# EasyEDA Pro project ProProject_aDataFlow_v2_pub_2024-01-13.epro, board PCB_front_1
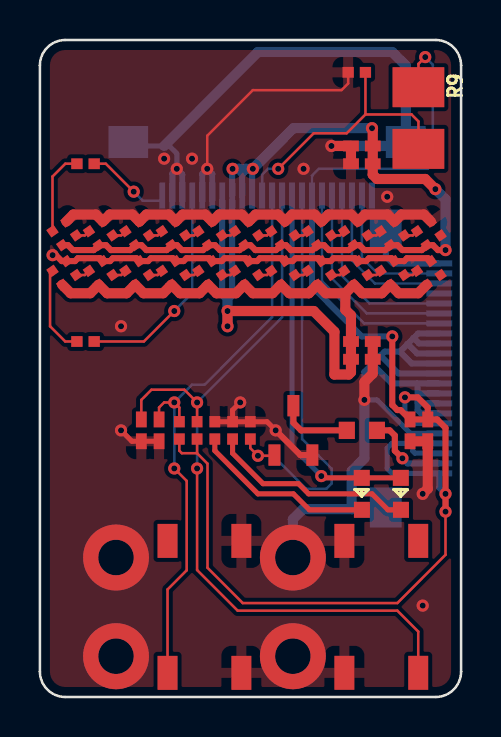
[diagram p5: board, top side]
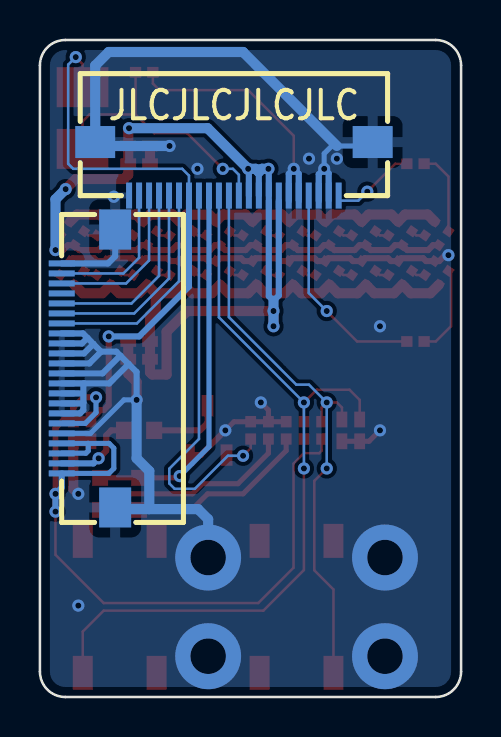
[diagram p6: board, bottom side, seen from below]

Outline 21.1 x 32.86 mm; copper layers: Top Layer, Bottom Layer. Coordinates in mm from the lower left corner of the outline.
Outline path: 0,31.59 0,1.27 arc(0.37,0.37) 1.27,0 19.83,0 arc(20.73,0.37) 21.1,1.27 21.1,31.59 arc(20.73,32.49) 19.83,32.86 1.27,32.86 arc(0.37,32.49) 0,31.59
Stack: Top Layer 0.035mm / Dielectric1 1.51mm FR4 er 4.5 / Bottom Layer 0.035mm

## Design rules (mm)
template: JLCPCB Capability(Two Layers Board)
spacing copperThickness1oz (default): track to track 0.102, other pairs 0.152 to 0.3
spacing copperThickness2oz: track to track 0.203, other pairs 0.152 to 0.3
track width copperThickness1oz (default): min 0.127, default 0.254, max 2.54
track width copperThickness2oz: min 0.203, default 0.254, max 2.54
differential pair differentialPair (default): width min 0.127, default 0.254, max 2.54; gap min 0.152, default 0.152
via viaSize (default): diameter min 0.5, default 0.61, max 10; hole min 0.3, default 0.305, max 6.3

## Placement (name value [footprint] x y rotation side)
C1  4.7uF  [C0402]  16.13 26.67 180 top
C2  4.7uF  [C0402]  16.13 27.56 180 top
C3  4.7uF  [C0402]  16.13 16.89 0 top
C4  4.7uF  [C0402]  16.13 17.78 0 top
C5  100nF  [C0402]  5.97 13.34 270 top
C6  100nF  [C0402]  5.08 13.34 270 top
C7  4.7uF  [C0402]  18.54 13.34 90 top
C8  100nF  [C0402]  19.43 13.34 90 top
FPC1  AFC01-S22FCA-00  [FPC-SMD_P0.5-22P_FGS-XJ-H2.0]  11.38 26.42 180 bottom
FPC2  AFC01-S22FCA-00  [FPC-SMD_P0.5-22P_FGS-XJ-H2.0]  18.67 16.43 270 bottom
LED1  KT-0603R  [LED0603-RD]  18.09 10.16 90 top
LED2  KT-0603R  [LED0603-RD]  16.13 10.16 90 top
Q1  AO3400A  [SOT-23-3_L2.9-W1.6-P1.90-LS2.8-BR]  12.7 13.34 270 top
R1  330Ω  [R0402]  2.29 26.67 180 top
R2  330Ω  [R0402]  2.29 17.78 180 top
R3  10kΩ  [R0402]  6.99 13.34 270 top
R4  10kΩ  [R0402]  7.87 13.34 270 top
R5  1kΩ  [R0402]  9.65 13.34 270 top
R6  1kΩ  [R0402]  8.76 13.34 270 top
R7  10Ω  [R0603]  16.13 13.34 0 top
R8  10kΩ  [R0402]  10.54 13.34 90 top
R9  GT36516  [RES-SMD_L3.6-W2.4]  18.96 28.96 270 top
R10  10kΩ  [R0402]  15.88 31.24 0 top
SW1  TS-1187A-B-A-B  [SW-SMD_4P-L5.1-W5.1-P3.70-LS6.5-TL-2]  8.24 4.51 90 top
SW2  TS-1187A-B-A-B  [SW-SMD_4P-L5.1-W5.1-P3.70-LS6.5-TL-2]  17.1 4.51 90 top
U1  XL-1010RGBC-WS2812B  [LED-SMD_4P-L1.0-W1.0-TL_XL-1010RGBC-WS2812B]  1.22 23.19 215 top
U2  XL-1010RGBC-WS2812B  [LED-SMD_4P-L1.0-W1.0-TL_XL-1010RGBC-WS2812B]  3.05 23.19 215 top
U3  XL-1010RGBC-WS2812B  [LED-SMD_4P-L1.0-W1.0-TL_XL-1010RGBC-WS2812B]  4.87 23.19 215 top
U4  XL-1010RGBC-WS2812B  [LED-SMD_4P-L1.0-W1.0-TL_XL-1010RGBC-WS2812B]  6.7 23.19 215 top
U5  XL-1010RGBC-WS2812B  [LED-SMD_4P-L1.0-W1.0-TL_XL-1010RGBC-WS2812B]  8.53 23.19 215 top
U6  XL-1010RGBC-WS2812B  [LED-SMD_4P-L1.0-W1.0-TL_XL-1010RGBC-WS2812B]  10.35 23.19 215 top
U7  XL-1010RGBC-WS2812B  [LED-SMD_4P-L1.0-W1.0-TL_XL-1010RGBC-WS2812B]  12.18 23.19 215 top
U8  XL-1010RGBC-WS2812B  [LED-SMD_4P-L1.0-W1.0-TL_XL-1010RGBC-WS2812B]  14 23.19 215 top
U9  XL-1010RGBC-WS2812B  [LED-SMD_4P-L1.0-W1.0-TL_XL-1010RGBC-WS2812B]  15.83 23.19 215 top
U10  XL-1010RGBC-WS2812B  [LED-SMD_4P-L1.0-W1.0-TL_XL-1010RGBC-WS2812B]  17.66 23.19 215 top
U11  XL-1010RGBC-WS2812B  [LED-SMD_4P-L1.0-W1.0-TL_XL-1010RGBC-WS2812B]  19.48 23.19 215 top
U12  XL-1010RGBC-WS2812B  [LED-SMD_4P-L1.0-W1.0-TL_XL-1010RGBC-WS2812B]  1.22 21.21 215 top
U13  XL-1010RGBC-WS2812B  [LED-SMD_4P-L1.0-W1.0-TL_XL-1010RGBC-WS2812B]  3.05 21.21 215 top
U14  XL-1010RGBC-WS2812B  [LED-SMD_4P-L1.0-W1.0-TL_XL-1010RGBC-WS2812B]  4.87 21.21 215 top
U15  XL-1010RGBC-WS2812B  [LED-SMD_4P-L1.0-W1.0-TL_XL-1010RGBC-WS2812B]  6.7 21.21 215 top
U16  XL-1010RGBC-WS2812B  [LED-SMD_4P-L1.0-W1.0-TL_XL-1010RGBC-WS2812B]  8.53 21.21 215 top
U17  XL-1010RGBC-WS2812B  [LED-SMD_4P-L1.0-W1.0-TL_XL-1010RGBC-WS2812B]  10.35 21.21 215 top
U18  XL-1010RGBC-WS2812B  [LED-SMD_4P-L1.0-W1.0-TL_XL-1010RGBC-WS2812B]  12.18 21.21 215 top
U19  XL-1010RGBC-WS2812B  [LED-SMD_4P-L1.0-W1.0-TL_XL-1010RGBC-WS2812B]  14 21.21 215 top
U20  XL-1010RGBC-WS2812B  [LED-SMD_4P-L1.0-W1.0-TL_XL-1010RGBC-WS2812B]  15.83 21.21 215 top
U21  XL-1010RGBC-WS2812B  [LED-SMD_4P-L1.0-W1.0-TL_XL-1010RGBC-WS2812B]  17.66 21.21 215 top
U22  XL-1010RGBC-WS2812B  [LED-SMD_4P-L1.0-W1.0-TL_XL-1010RGBC-WS2812B]  19.48 21.21 215 top

## Footprints (pads in the part's own frame, mm; a bottom-side part is the same pattern mirrored in y, then rotated)
C0402
  rect 0.79x0.54 smd: 1(-0.545,0) 2(0.545,0)
FPC-SMD_P0.5-22P_FGS-XJ-H2.0
  rect 0.3x1.3 smd: 1(-5.252,-1.338) 2(-4.752,-1.338) 3(-4.252,-1.338) 4(-3.752,-1.338) 5(-3.252,-1.338) 6(-2.752,-1.338) 7(-2.252,-1.338) 8(-1.752,-1.338) 9(-1.25,-1.339) 10(-0.752,-1.338) 11(-0.252,-1.338) 12(0.248,-1.338) 13(0.748,-1.338) 14(1.248,-1.338) 15(1.748,-1.338) 16(2.248,-1.338) 17(2.748,-1.338) 18(3.248,-1.338) 19(3.748,-1.338) 20(4.25,-1.339) 21(4.748,-1.338) 22(5.248,-1.338)
  rect 2x1.6 smd: 23(6.95,1.339) 24(-6.95,1.339)
LED0603-RD
  rect 0.8x0.8 smd: 1(-0.799,-0.004) 2(0.799,0.004)
LED-SMD_4P-L1.0-W1.0-TL_XL-1010RGBC-WS2812B
  rect 0.45x0.45 smd: 1(-0.425,0.424) 2(0.425,0.425) 3(-0.425,-0.425) 4(0.425,-0.425)
R0402
  rect 0.566x0.54 smd: 1(-0.433,0) 2(0.433,0)
R0603
  rect 0.806x0.864 smd: 1(-0.753,0) 2(0.753,0)
RES-SMD_L3.6-W2.4
  rect 2x2.592 smd: 1(-1.542,0) 2(1.542,0)
SOT-23-3_L2.9-W1.6-P1.90-LS2.8-BR
  rect 1.07x0.6 smd: 1(1.235,-0.95) 2(1.235,0.95) 3(-1.235,0)
SW-SMD_4P-L5.1-W5.1-P3.70-LS6.5-TL-2
  rect 1.7x1 smd: 1(-3.3,1.85) 2(3.3,1.85) 3(-3.3,-1.85) 4(3.3,-1.85)

## Nets
As in the schematic.

Pads without a net: FPC2 4; SW1 2; SW2 4; U11 1; U22 1

## Via types
v1: diameter 0.61, hole 0.305, Top Layer to Bottom Layer, 37 vias
v2: diameter 3.302, hole 1.778, Top Layer to Bottom Layer, 4 vias

## Routing (per net, layer and track width the routed paths; a pad name or vN(x,y) marks a point on that pad's centre or on a via; arc(x,y) is an arc through that point)
3V3: length 73.4
  Top Layer w0.127: v1(20.32,9.27) 20.32,7.11 17.91,4.7 10.16,4.7 8.4,6.47 8.4,11.67 7.87,12.19 ; R9.1 18.96,31.66 v1(19.3,32) ; 7.87,12.19 7.11,12.19 6.99,12.32 6.99,12.9 ; 7.87,12.19 7.87,12.9
  Top Layer w0.305: 19.43,13.88 19.9,13.88 20.32,13.46 v1(20.32,10.16) v1(20.32,9.27) ; 19.43,13.88 18.54,13.88 18.07,14.35 17.91,14.35 17.65,14.61 v1(17.65,18.03) ; 19.43,13.88 19.43,14.48 18.92,14.99 v1(18.29,14.99)
  Bottom Layer w0.127: v1(19.3,32) 19.69,31.62 19.69,26.67 19.43,26.42 13.97,26.42 13.63,26.08 FPC1.7
  Bottom Layer w0.254: FPC2.17 18.83,13.68 18.29,14.22 v1(18.29,14.99) ; FPC2.19 18.68,12.68 ; 18.68,12.68 18.68,12.31 18.8,12.19 20,12.19 FPC2.20 ; 18.68,12.68 17.64,12.68 17.4,12.45 17.4,11.43 17.65,11.18 FPC2.22
  Bottom Layer w0.305: v1(17.65,18.03) 16.13,18.03 13.63,20.53 13.63,24.83 ; FPC2.22 20.01,10.47 v1(20.32,10.16) v1(20.32,9.27)
+5V: length 89.1
  Top Layer w0.305: v1(20.32,22.35) 19.94,22.35 19.69,22.6 U11.2 19.13,22.35 18.16,22.35 17.91,22.6 U10.2 17.31,22.35 16.26,22.35 16.01,22.6 U9.2 15.48,22.35 14.48,22.35 14.23,22.6 U8.2 13.65,22.35 12.57,22.35 12.33,22.6 U7.2 11.83,22.35 10.79,22.35 10.55,22.6 U6.2 10,22.35 9.02,22.35 8.77,22.6 U5.2 8.18,22.35 7.11,22.35 6.87,22.6 U4.2 6.35,22.35 5.33,22.35 5.09,22.6 U3.2 4.52,22.35 3.56,22.35 3.31,22.6 U2.2 2.7,22.35 1.65,22.35 1.4,22.6 U1.2
  Top Layer w0.508: 15.3,20.19 14.32,20.19 U19.2 13.47,20.19 12.5,20.19 U18.2 11.65,20.19 10.67,20.19 U17.2 9.82,20.19 8.85,20.19 U16.2 8,20.19 7.02,20.19 U15.2 6.17,20.19 5.19,20.19 U14.2 4.34,20.19 3.37,20.19 U13.2 2.52,20.19 1.54,20.19 U12.2 ; 15.3,20.19 U20.2 16.15,20.19 17.13,20.19 U21.2 17.98,20.19 18.95,20.19 U22.2 ; 15.3,20.19 15.3,19.37 15.58,19.09 C4.1 C3.1 15.58,16.24 15.47,16.13 14.75,16.13 14.75,18.27 13.72,19.3 v1(9.4,19.3) v1(9.4,18.54) ; v1(16.64,28.45) 16.67,28.41 C2.1 C1.1 16.67,26.13 16.89,25.91 19.3,25.91 v1(19.81,25.4)
  Bottom Layer w0.305: FPC1.14 10.13,26.26 ; FPC1.13 10.63,26.38 v1(10.67,26.42) ; 9.63,24.83 9.63,20.05 9.4,19.81 9.13,20.08 9.13,24.83 ; v1(9.65,26.42) 9.63,26.4 FPC1.15
  Bottom Layer w0.508: v1(16.64,28.45) 12.7,28.45 v1(10.67,26.42) 10.29,26.42 10.13,26.26 9.98,26.42 v1(9.65,26.42) ; v1(19.81,25.4) 20.32,24.89 v1(20.32,22.35) ; 9.4,19.81 v1(9.4,19.3) v1(9.4,18.54)
GND: length 145.6
  Top Layer w0.127: v1(8.38,26.42) 8.38,28.07 10.67,30.35 15.11,30.35 15.44,30.68 R10.1
  Top Layer w0.254: v1(4.06,13.34) 4.61,12.79 C6.2 C5.2 ; v1(10.03,14.73) 9.65,14.35 R5.1 ; R5.1 R8.2 11.38,13.77 v1(11.81,13.34) ; R5.1 R6.1
  Top Layer w0.305: Q1.2 13.05,12.1 v1(11.81,13.34) ; v1(0.63,22.1) 0.8,22.1 1.1,21.8 U12.3 1.76,21.8 1.9,21.95 3.01,21.95 3.15,21.8 3.51,21.8 3.66,21.95 4.83,21.95 U14.3 5.42,21.8 5.56,21.95 6.66,21.95 6.8,21.8 7.2,21.8 7.34,21.95 8.49,21.95 8.63,21.8 9.1,21.8 9.25,21.95 10.31,21.95 U17.3 10.88,21.8 11.02,21.95 12.14,21.95 12.28,21.8 12.66,21.8 12.8,21.95 13.96,21.95 U19.3 14.56,21.8 14.71,21.95 15.79,21.95 15.93,21.8 16.34,21.8 16.48,21.95 17.62,21.95 U21.3 18.25,21.8 18.39,21.95 19.44,21.95 19.59,21.8
  Top Layer w0.508: 19.59,23.78 19.24,24.13 18.11,24.13 17.76,23.78 17.41,24.13 16.28,24.13 U9.3 15.59,24.13 14.46,24.13 U8.3 13.76,24.13 12.63,24.13 U7.3 11.93,24.13 10.81,24.13 U6.3 10.11,24.13 8.98,24.13 U5.3 8.28,24.13 7.15,24.13 U4.3 6.46,24.13 5.33,24.13 4.99,23.78 U3.3 4.63,24.13 3.5,24.13 U2.3 2.8,24.13 1.67,24.13 U1.3 ; C4.2 C3.2 16.67,16.17 16.26,15.75 v1(16.26,14.86) ; v1(19.18,10.16) 19.43,10.41 C8.1 C7.1 ; v1(14.6,27.56) C2.2 C1.2
  Bottom Layer w0.254: 4.43,27.5 4.49,27.56 6.48,27.56 6.86,27.18 v1(6.86,26.42) ; v1(16.26,14.86) 16.89,14.86 18.57,13.18 FPC2.18
  Bottom Layer w0.305: 18.72,17.96 18.42,17.66 ; 18.72,17.96 18.99,17.68 FPC2.9 ; 18.72,17.96 18.95,18.18 FPC2.8 ; 18.42,17.66 18.03,17.27 ; 18.42,17.66 18.89,17.18 FPC2.10 ; v1(16.26,14.86) 16.26,16.26 16.65,16.66 ; 17.07,17.07 17.27,17.27 18.03,17.27 ; 17.07,17.07 17.96,16.18 FPC2.12 ; 17.07,17.07 16.65,16.66 ; 18.03,17.27 18.62,16.68 FPC2.11 ; FPC2.15 18.96,14.68 18.92,14.73 ; 18.89,15.68 17.62,15.68 16.65,16.66 ; 18.89,15.68 18.92,15.65 18.92,14.73 ; 18.89,15.68 FPC2.13 ; 18.92,14.73 18.92,14.35 19.09,14.18 FPC2.16 ; FPC2.1 17.69,21.68 17.33,22.04 FPC2.24 ; 8.63,24.83 8.63,26.17 v1(8.38,26.42) 8.13,26.17 8.13,24.83 ; 7.13,24.82 7.13,26.14 v1(6.86,26.42) 6.63,26.19 6.63,24.83 ; FPC2.14 19.11,15.18
  Bottom Layer w0.508: 15.63,9.4 13.18,9.4 12.67,8.89 v2(12.67,6.98) ; 15.63,9.4 15.62,9.41 15.62,11.3 16.26,11.94 v1(16.26,14.86) ; 15.63,9.4 17.25,9.4 FPC2.23 ; 6.22,27.56 10.92,32.26 17.65,32.26 18.33,31.58 18.33,27.5 18.27,27.56 v1(14.6,27.56)
  vias: v1(4.06,18.54) v1(6.22,26.92) v1(7.62,26.92) v1(13.21,26.42) v1(17.4,25.02) v1(19.18,4.57) v2(3.81,6.98) v2(3.81,2.04) v2(12.67,2.04)
ADC_LIGHT: length 14
  Top Layer w0.127: 16.31,29.14 R10.2 ; 16.31,29.14 15.37,28.19 13.72,28.19 v1(11.94,26.42) ; 16.31,29.14 18.62,29.14 18.96,28.79 18.96,27.41
  Bottom Layer w0.127: v1(11.94,26.42) 11.43,26.42 11.13,26.12 11.13,24.83
BTN_CHART: length 29.2
  Top Layer w0.127: SW1.1 6.39,5.38 7.35,6.34 7.35,10.81 v1(6.73,11.43) ; 5.97,13.88 5.97,14.48 6.22,14.73 v1(6.73,14.73) 6.99,14.48 R3.1
  Bottom Layer w0.127: v1(6.73,11.43) v1(6.73,14.73) 7.62,15.62 8.25,15.62 11.63,19 11.63,24.83
BTN_REC: length 39.9
  Top Layer w0.127: SW2.3 18.95,3.27 17.91,4.32 9.91,4.32 7.87,6.35 v1(7.87,11.43) ; R4.1 v1(7.87,14.73) 7.24,15.37 5.59,15.37 5.08,14.86 5.08,13.88
  Bottom Layer w0.127: v1(7.87,11.43) v1(7.87,14.73) 12.13,18.99 12.13,24.83
LCD_BLK: length 21.1
  Top Layer w0.127: Q1.1 11.72,12.07 v1(10.92,12.07) 10.54,12.45 10.54,12.9
  Bottom Layer w0.127: 13.13,24.83 13.13,12.9 14.62,11.42 14.62,10.68 14.35,10.41 13.34,10.41 11.68,12.07 v1(10.92,12.07)
LCD_BLKK: length 4.3
  Top Layer w0.305: v1(18.16,11.94) 17.78,12.32 17.78,13.08 17.53,13.34 R7.2
  Bottom Layer w0.305: v1(18.16,11.94) 18.42,11.68 FPC2.21
LCD_CS: length 9.2
  Bottom Layer w0.127: FPC2.5 16.51,19.68 15.13,21.06 15.13,24.83
LCD_DC: length 10.8
  Bottom Layer w0.127: FPC2.7 16.24,18.68 14.13,20.79 14.13,24.83
LCD_RES: length 7.8
  Bottom Layer w0.127: 15.63,24.83 15.63,21.83 16.78,20.68 FPC2.3
LCD_SCL: length 10
  Bottom Layer w0.127: 14.63,24.83 14.63,20.93 16.38,19.18 FPC2.6
LCD_SDA: length 7.1
  Bottom Layer w0.127: FPC2.2 16.92,21.18 16.13,21.97 16.13,24.83
LED_REC: length 18.4
  Top Layer w0.254: LED1.2 LED2.2 14.19,10.96 v1(14.1,11.05)
  Bottom Layer w0.254: v1(14.1,11.05) 12.63,12.52 12.63,24.82
WS2812B_S1: length 4.2
  Top Layer w0.127: v1(4.7,25.27) 3.3,26.67 R1.1
  Bottom Layer w0.127: v1(4.7,25.27) 5.15,24.83 6.13,24.83
WS2812B_S2: length 10.5
  Top Layer w0.127: R2.1 5.21,17.78 v1(6.73,19.3)
  Bottom Layer w0.127: 7.63,24.83 7.63,20.21 v1(6.73,19.3)
$1N953: length 0.7
  Top Layer w0.127: U2.4 2.25,23.09 U1.1
$1N956: length 0.7
  Top Layer w0.127: U2.1 4.07,23.09 U3.4
$1N959: length 0.7
  Top Layer w0.127: U3.1 5.9,23.09 U4.4
$1N1148: length 0.7
  Top Layer w0.127: U5.1 9.55,23.09 U6.4
$1N1150: length 0.7
  Top Layer w0.127: U6.1 11.38,23.09 U7.4
$1N1152: length 0.7
  Top Layer w0.127: U7.1 13.2,23.09 U8.4
$1N1342: length 0.7
  Top Layer w0.127: U9.1 16.85,23.09 U10.4
$1N1344: length 0.7
  Top Layer w0.127: 18.89,23.3 18.68,23.09 U10.1
$1N1350: length 0.7
  Top Layer w0.127: U5.4 7.73,23.09 U4.1
$1N1353: length 0.7
  Top Layer w0.127: U8.1 15.03,23.09 U9.4
$1N1918: length 0.7
  Top Layer w0.127: 2.46,21.31 2.25,21.11 U12.1
$1N1920: length 0.7
  Top Layer w0.127: U14.4 4.07,21.11 U13.1
$1N1922: length 0.7
  Top Layer w0.127: 6.11,21.31 5.9,21.11 U14.1
$1N1924: length 0.7
  Top Layer w0.127: U16.1 9.55,21.11 U17.4
$1N1926: length 0.7
  Top Layer w0.127: 11.59,21.31 11.38,21.11 U17.1
$1N1928: length 0.7
  Top Layer w0.127: U18.1 13.2,21.11 U19.4
$1N1930: length 0.7
  Top Layer w0.127: U21.4 16.86,21.11 U20.1
$1N1932: length 0.7
  Top Layer w0.127: 18.89,21.31 18.68,21.11 U21.1
$1N1936: length 0.7
  Top Layer w0.127: 7.93,21.31 7.73,21.11 U15.1
$1N1938: length 0.7
  Top Layer w0.127: U19.1 15.03,21.11 15.24,21.31
$1N16042: length 10.3
  Top Layer w0.254: LED1.1 17.44,9.36 16.64,10.16 13.46,10.16 12.95,10.67 11.18,10.67 9.65,12.19 9.65,12.9
$1N16085: length 9.2
  Top Layer w0.254: LED2.1 13.5,9.36 12.7,10.16 10.92,10.16 8.76,12.32 8.76,12.9
$1N17559: length 4.2
  Top Layer w0.127: U1.4 0.63,26.03 1.27,26.67 R1.2
$1N17604: length 4.5
  Top Layer w0.127: U12.4 0.51,21.19 0.51,18.54 1.27,17.78 R2.2
$1N26288: length 3.7
  Top Layer w0.305: R7.1 13.08,13.34 12.7,13.72 Q1.3

## Copper pours and planes (outline as drawn; the poured copper is in the pictures)
GND on Top Layer: -2.54,35.05 24.64,35.05 24.64,-3.43 -2.54,-3.43
GND on Bottom Layer: -4.83,33.53 27.56,33.53 27.56,-1.02 -4.83,-1.02

## Text on the board
Bottom Solder Mask Layer: 20231224XM-2.51
Bottom Silkscreen Layer: JLCJLCJLCJLC
Top Solder Mask Layer: ⭐️ SPECIAL EDITION ⭐️ | aDataFlow™️
